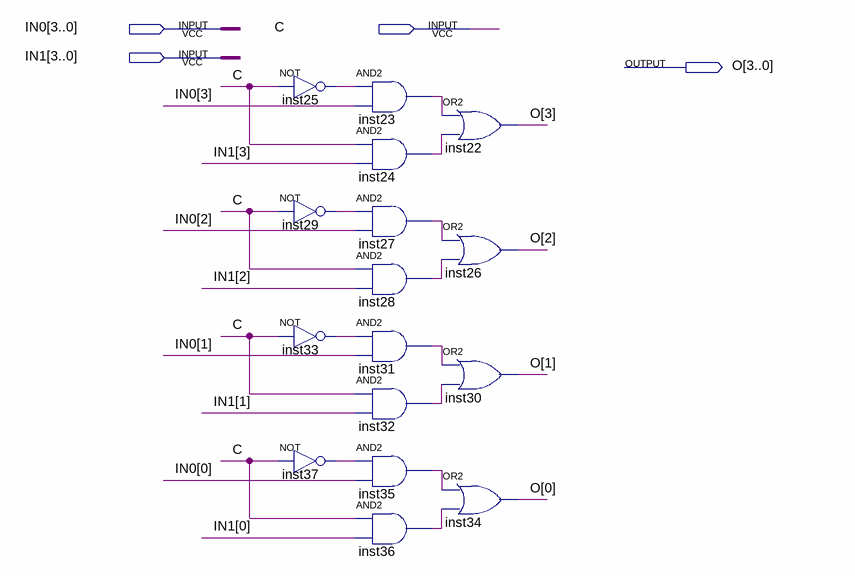
[diagram p0: schematic sheet]
// Quartus schematic 2MUX1.bdf as structural Verilog: 16 symbols, 4 pins
module \2MUX1  (
  input  [3:0] IN0,
  input  C,
  input  [3:0] IN1,
  output [3:0] O
);

  wire inst23_out, inst24_out, inst25_out, inst27_out, inst28_out, inst29_out, inst31_out, inst32_out,
       inst33_out, inst35_out, inst36_out, inst37_out;

  not inst25 (inst25_out, C);
  not inst29 (inst29_out, C);
  not inst33 (inst33_out, C);
  not inst37 (inst37_out, C);
  and inst23 (inst23_out, inst25_out, IN0[3]);
  and inst24 (inst24_out, C, IN1[3]);
  and inst27 (inst27_out, inst29_out, IN0[2]);
  and inst28 (inst28_out, C, IN1[2]);
  and inst31 (inst31_out, inst33_out, IN0[1]);
  and inst32 (inst32_out, C, IN1[1]);
  and inst35 (inst35_out, inst37_out, IN0[0]);
  and inst36 (inst36_out, C, IN1[0]);
  or inst22 (O[3], inst23_out, inst24_out);
  or inst26 (O[2], inst27_out, inst28_out);
  or inst30 (O[1], inst31_out, inst32_out);
  or inst34 (O[0], inst35_out, inst36_out);
endmodule
